# Altium schematic sheet MotionGlove.SchDoc
size A3
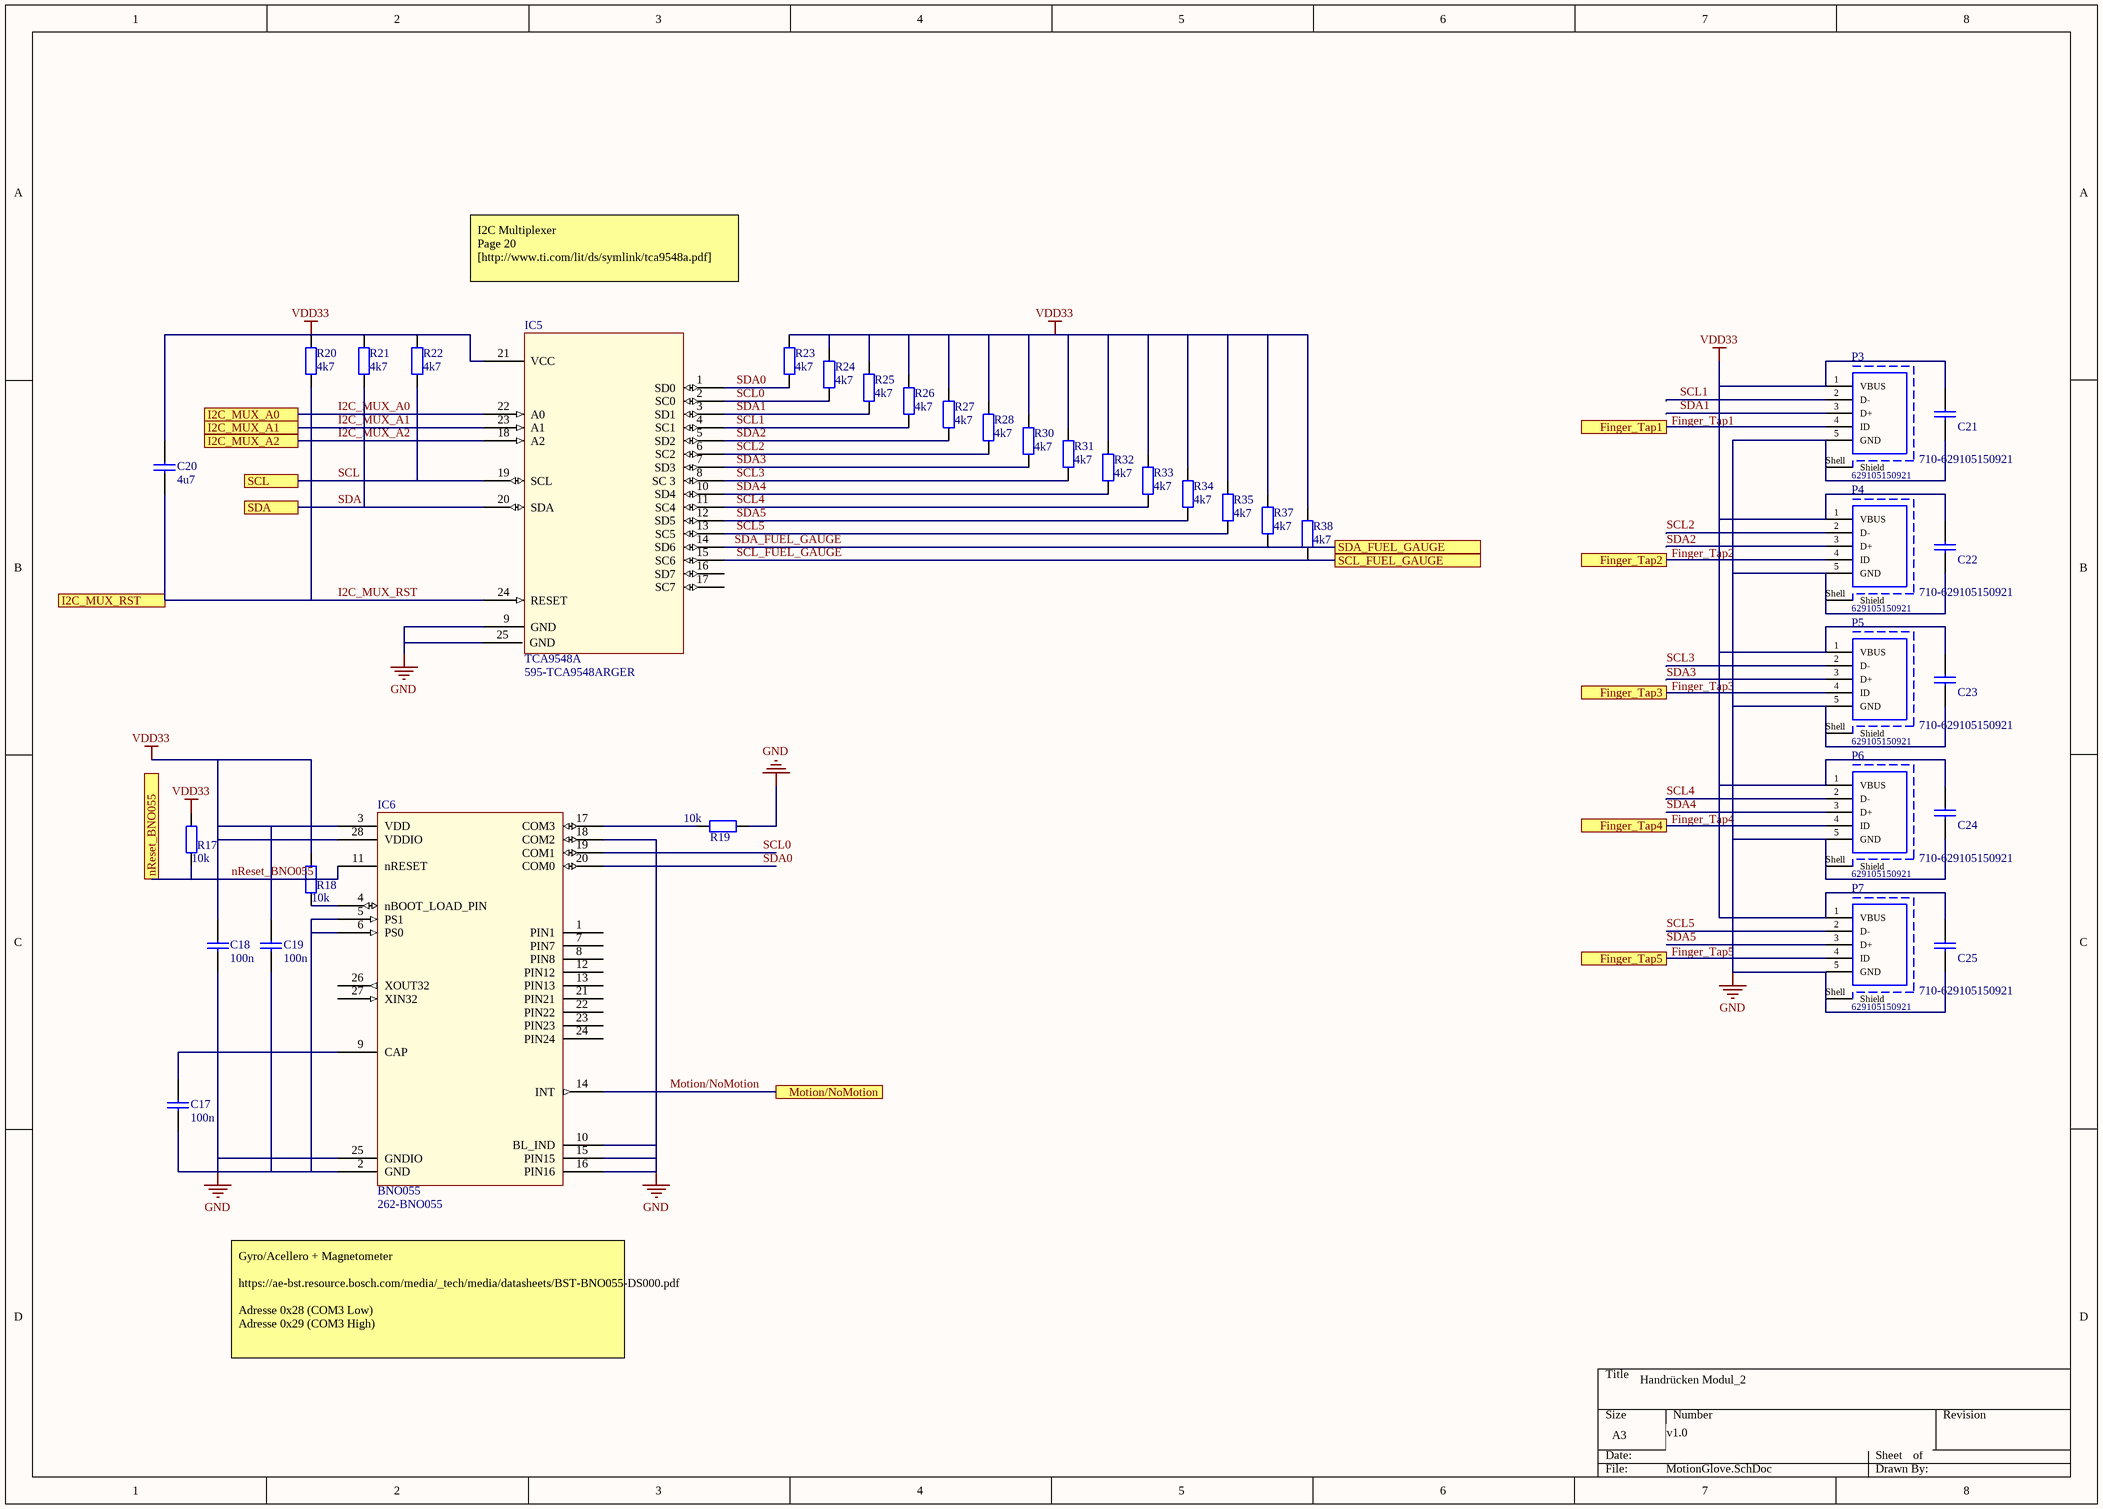
[diagram p0: MotionGlove.SchDoc]

## Parts
C17  100n  [CAPC1005X55]
C18  100n  [CAPC1005X55]
C19  100n  [CAPC1005X55]
C20  4u7  [CAPC1005X55]
C21  100n  [CAPC1005X55]  (value not drawn)
C22  100n  [CAPC1005X55]  (value not drawn)
C23  100n  [CAPC1005X55]  (value not drawn)
C24  100n  [CAPC1005X55]  (value not drawn)
C25  100n  [CAPC1005X55]  (value not drawn)
IC5  TCA9548A  Supplier Part Number 1: 595-TCA9548ARGER  [TCA9548A-Q1]
IC6  BNO055  Supplier Part Number 1: 262-BNO055  [BNO055]
P3  629105150921  Supplier Part Number 1: 710-629105150921  [629105150921]
P4  629105150921  Supplier Part Number 1: 710-629105150921  [629105150921]
P5  629105150921  Supplier Part Number 1: 710-629105150921  [629105150921]
P6  629105150921  Supplier Part Number 1: 710-629105150921  [629105150921]
P7  629105150921  Supplier Part Number 1: 710-629105150921  [629105150921]
R17  10k  [RESC1005X40]
R18  10k  [RESC1005X40]
R19  10k  [RESC1005X40]
R20  4k7  [RESC1005X40]
R21  4k7  [RESC1005X40]
R22  4k7  [RESC1005X40]
R23  4k7  [RESC1005X40]
R24  4k7  [RESC1005X40]
R25  4k7  [RESC1005X40]
R26  4k7  [RESC1005X40]
R27  4k7  [RESC1005X40]
R28  4k7  [RESC1005X40]
R30  4k7  [RESC1005X40]
R31  4k7  [RESC1005X40]
R32  4k7  [RESC1005X40]
R33  4k7  [RESC1005X40]
R34  4k7  [RESC1005X40]
R35  4k7  [RESC1005X40]
R37  4k7  [RESC1005X40]
R38  4k7  [RESC1005X40]

## Ports
Finger_Tap1, Finger_Tap2, Finger_Tap3, Finger_Tap4, Finger_Tap5, I2C_MUX_A0, I2C_MUX_A1, I2C_MUX_A2, I2C_MUX_RST, Motion/NoMotion, nReset_BNO055, SCL, SCL_FUEL_GAUGE, SDA, SDA_FUEL_GAUGE

## Nets
GND: C17.1 C18.1 C19.1 C21.1 C22.1 C23.1 C24.1 C25.1 IC5.9(GND) IC5.25(GND) IC6.2(GND) IC6.5(PS1) IC6.6(PS0) IC6.10(BL_IND) IC6.15(PIN15) IC6.16(PIN16) IC6.18(COM2) IC6.25(GNDIO) P3.5(GND) P3.Shell(Shield) P4.5(GND) P4.Shell(Shield) P5.5(GND) P5.Shell(Shield) P6.5(GND) P6.Shell(Shield) P7.5(GND) P7.Shell(Shield) R19.2
VDD33: C18.2 C19.2 C20.2 C21.2 C22.2 C23.2 C24.2 C25.2 IC5.21(VCC) IC6.3(VDD) IC6.28(VDDIO) P3.1(VBUS) P4.1(VBUS) P5.1(VBUS) P6.1(VBUS) P7.1(VBUS) R17.2 R18.2 R20.2 R21.2 R22.2 R23.2 R24.2 R25.2 R26.2 R27.2 R28.2 R30.2 R31.2 R32.2 R33.2 R34.2 R35.2 R37.2 R38.2
Finger_Tap1: P3.4(ID) ; port Finger_Tap1
Finger_Tap2: P4.4(ID) ; port Finger_Tap2
Finger_Tap3: P5.4(ID) ; port Finger_Tap3
Finger_Tap4: P6.4(ID) ; port Finger_Tap4
Finger_Tap5: P7.4(ID) ; port Finger_Tap5
I2C_MUX_A0: IC5.22(A0) ; port I2C_MUX_A0
I2C_MUX_A1: IC5.23(A1) ; port I2C_MUX_A1
I2C_MUX_A2: IC5.18(A2) ; port I2C_MUX_A2
I2C_MUX_RST: C20.1 IC5.24(RESET) R20.1 ; port I2C_MUX_RST
Motion/NoMotion: IC6.14(INT) ; port Motion/NoMotion
nReset_BNO055: IC6.11(nRESET) R17.1 ; port nReset_BNO055
SCL: IC5.19(SCL) R22.1 ; port SCL
SCL0: IC5.2(SC0) IC6.19(COM1) R24.1
SCL1: IC5.4(SC1) P3.2(D-) R26.1
SCL2: IC5.6(SC2) P4.2(D-) R28.1
SCL3: IC5.8(SC_3) P5.2(D-) R31.1
SCL4: IC5.11(SC4) P6.2(D-) R33.1
SCL5: IC5.13(SC5) P7.2(D-) R35.1
SCL_FUEL_GAUGE: IC5.15(SC6) R38.1 ; port SCL_FUEL_GAUGE
SDA: IC5.20(SDA) R21.1 ; port SDA
SDA0: IC5.1(SD0) IC6.20(COM0) R23.1
SDA1: IC5.3(SD1) P3.3(D+) R25.1
SDA2: IC5.5(SD2) P4.3(D+) R27.1
SDA3: IC5.7(SD3) P5.3(D+) R30.1
SDA4: IC5.10(SD4) P6.3(D+) R32.1
SDA5: IC5.12(SD5) P7.3(D+) R34.1
SDA_FUEL_GAUGE: IC5.14(SD6) R37.1 ; port SDA_FUEL_GAUGE
NetC17_2: C17.2 IC6.9(CAP)
NetIC6_4: IC6.4(nBOOT_LOAD_PIN) R18.1
NetIC6_17: IC6.17(COM3) R19.1

Not connected (* = marked no-connect by the designer): IC5 16(SD7) 17(SC7); IC6 1(PIN1) 7(PIN7) 8(PIN8) 12(PIN12) 13(PIN13) 21(PIN21) 22(PIN22) 23(PIN23) 24(PIN24) 26(XOUT32) 27(XIN32)

## Notes on the sheet
- I2C Multiplexer
  Page 20
  [http://www.ti.com/lit/ds/symlink/tca9548a.pdf]
  anschauen
  http://www.ti.com/lit/ds/symlink/pca9544a.pdf
- Gyro/Acellero + Magnetometer
  https://ae-bst.resource.bosch.com/media/_tech/media/datasheets/BST-BNO055-DS000.pdf
  Adresse 0x28 (COM3 Low)
  Adresse 0x29 (COM3 High)
- Handrücken Modul_2
- v1.0
- Labels drawn without touching a wire or pin: Finger_Tap1, Finger_Tap2, Finger_Tap3, Finger_Tap4, Finger_Tap5

## Library data of the parts
C17-C19 C21-C25 = 1066: Ceramic Chip Capacitor; Manufacturer ID: C0402C104K4RAC; Manufacturer: Kemet; ID: 1066; Type: Standard Ceramic; Voltage: 16V; Characteristic: X7R; Tolerance: ±15%; UBiKS Number: UBiKS-C00001I; Value: 100n; Dielectric: Ceramic; Footprint / Size: C0402; Farnell: 1288252; Digikey: 399-3521-1-ND; Distributor 3: Mouser; Distributor Number 3: 80-C0402C104K4RAUTO; Unit Price: 0; Quantity: 0; ComponentLink1Description: Website; ComponentLink1URL: http://kemet.com/; ComponentLink2Description: Datasheet; ComponentLink2URL: http://www.kemet.com/kemet/web/homepage/kechome.nsf/vapubfiles/F3102_X7R.pdf/$file/F3102_X7R.pdf
C20 = 1253: Ceramic Chip Capacitor; Manufacturer ID: GRM155R60J475ME47D; Manufacturer: Murata; ID: 1253; Type: Standard Ceramic; Voltage: 6.3V; Characteristic: X5R; Tolerance: ±20%; UBiKS Number: UBiKS-C00140A; Value: 4u7; Dielectric: Ceramic; Footprint / Size: C0402; Farnell: 2426952; ComponentLink1Description: Website; ComponentLink1URL: http://www.murata.com/; ComponentLink2Description: Datasheet; ComponentLink2URL: http://www.farnell.com/datasheets/1769893.pdf
P3-P7 = 629105150921: Micro USB 2.0 Type AB Receptacle WR-COM, Horizontal, SMT; Rated Current: 1.8 A; Contact Resistance: 30 mOhm; Working Voltage: 30 VAC; ComponentLink1Description: Manufacturer; ComponentLink1URL: http://www.we-online.de; ComponentLink2Description: Datasheet; ComponentLink2URL: https://katalog.we-online.de/em/datasheet/629105150921.pdf; Part Number: 629105150921; Published Date: September 2018; Publisher: Wurth Elektronik; Orientation: Horizontal; Connector Type: Micro USB 2.0 Type AB; Operating Temperature: -40 to 85 degC; Mounting Technology: SMT; Gender: Receptacle; Packaging: Tape and Reel; Supplier 1: Mouser
R17-R19 = 2123: Resistor; Manufacturer ID: MC 0.0625W 0402 1% 10K; Manufacturer: Multicomp; ID: 2123; Element Type: Thick Film; Tolerance: ±1%; Power rating: 0.063W; Temperatur coeff: ±100ppm/°C; UBiKS Number: UBiKS-R00007H; Type: Standard; Value: 10k; Footprint / Size: R0402; Farnell: 1358069; ComponentLink1Description: Website; ComponentLink2Description: Datasheet; ComponentLink2URL: http://www.farnell.com/datasheets/318400.pdf
R20-R28 R30-R35 R37 R38 = 2131: Resistor; Manufacturer ID: MC 0.0625W 0402 1% 4K7; Manufacturer: Multicomp; ID: 2131; Element Type: Thick Film; Tolerance: ±1%; Power rating: 0.063W; Temperatur coeff: ±100ppm/°C; UBiKS Number: UBiKS-R00015A; Type: Standard; Value: 4k7; Footprint / Size: R0402; Farnell: 1358060; ComponentLink1Description: Website; ComponentLink2Description: Datasheet; ComponentLink2URL: http://www.farnell.com/datasheets/318400.pdf
IC5 = TCA9548A: Supplier 1: Mouser
IC6 = BNO055: Supplier 1: Mouser